# EAGLE design MOD-W_V02 (EAGLE 9.6.2)

## Sheet 1 of 2
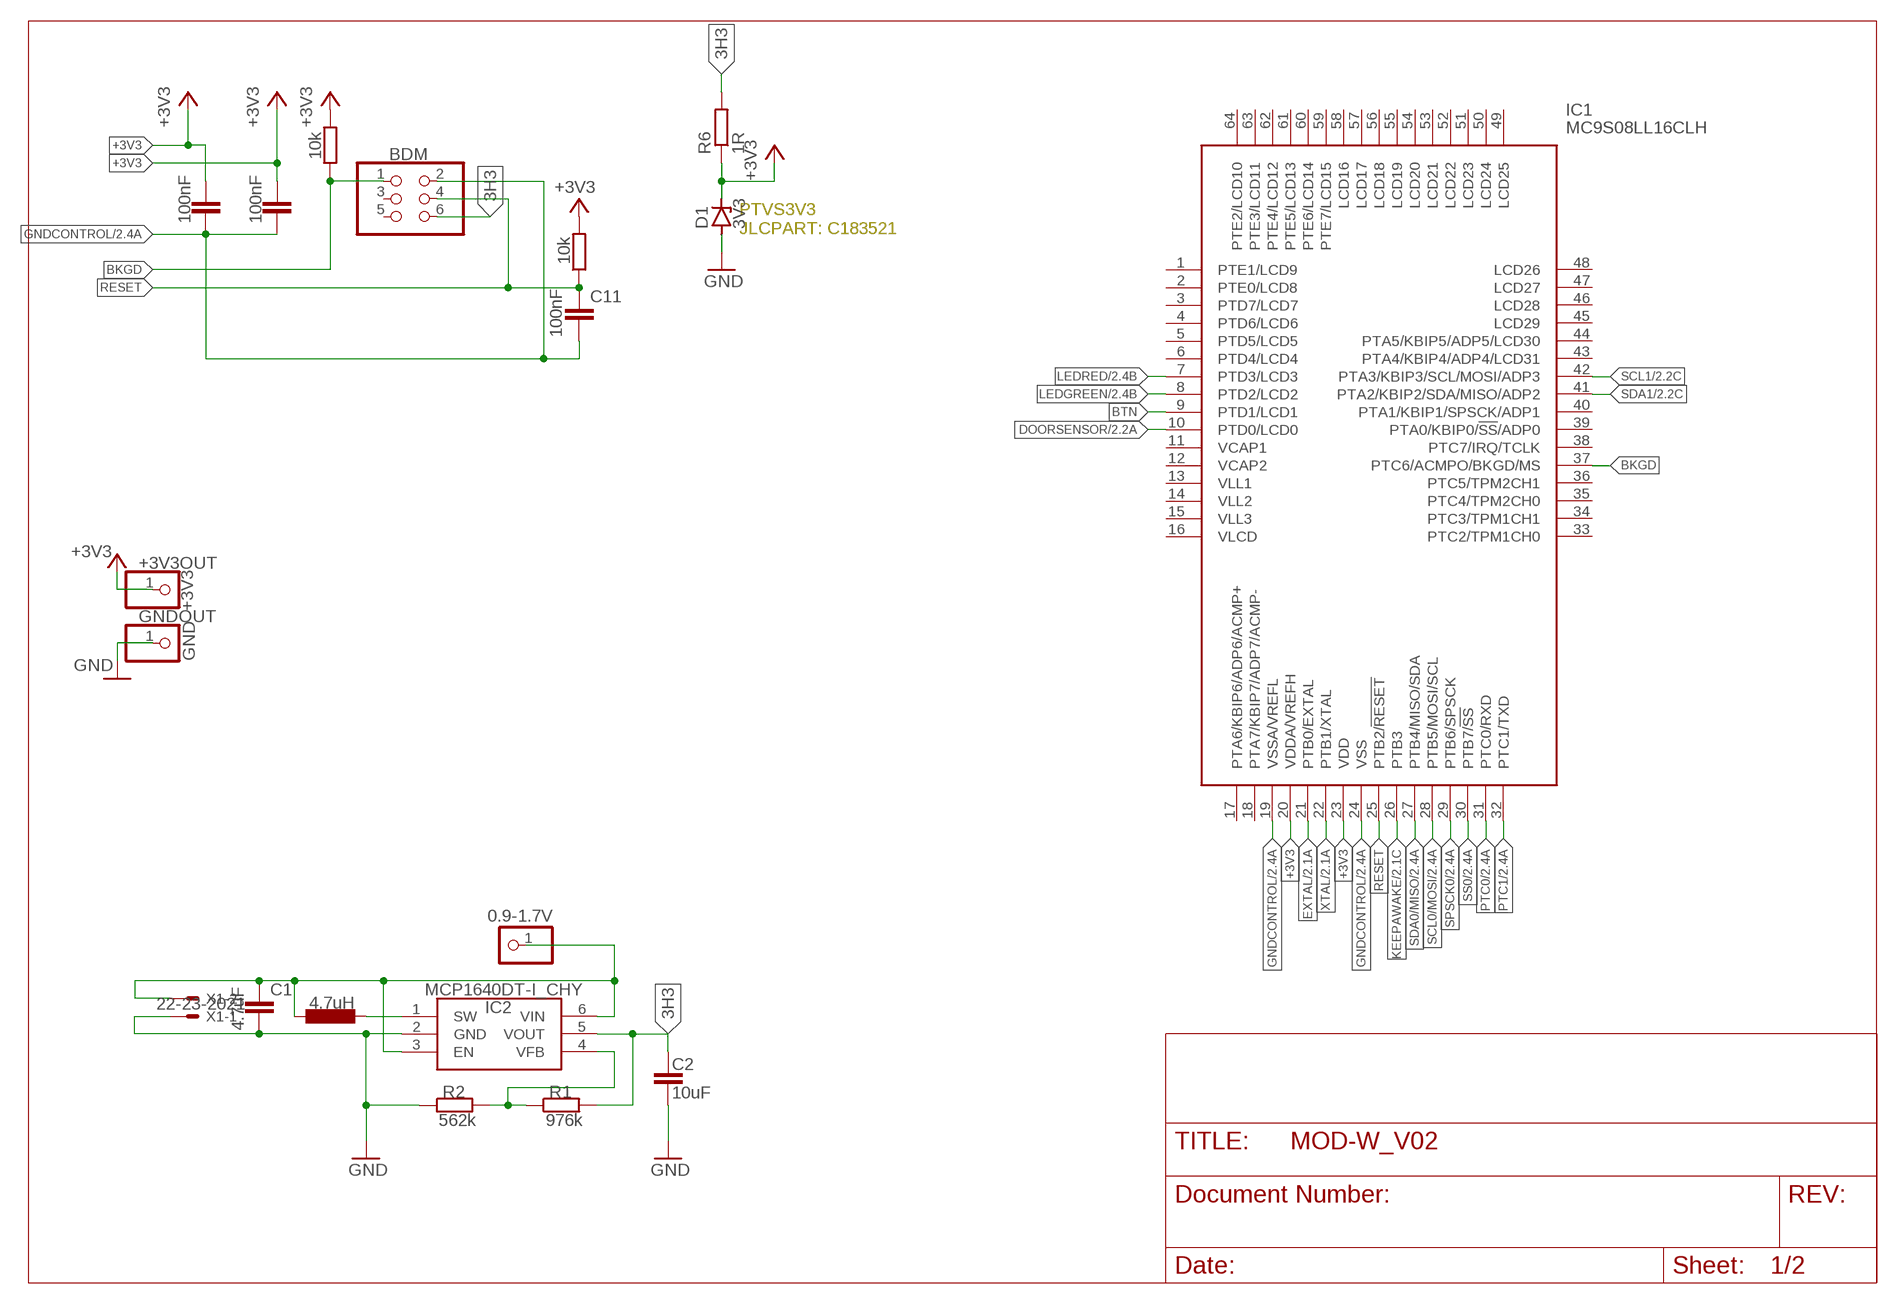
[diagram p0: schematic, sheet 1]

### Parts
+3V3OUT  +3V3  PINHD-1X1  [1X01]
BAT  0.9-1.7V  PINHD-1X1  [1X01]
BDM  PINHD-2X3  [2X03]
C1  4.7uF  C-EUC0805  [C0805]
C2  10uF  C-EUC0805  [C0805]
C9  100nF  C-EUC0805  [C0805]
C10  100nF  C-EUC0805  [C0805]
C11  100nF  C-EUC0805  [C0805]
D1  3V3  ZENER-DIODESOD80C  [SOD80C]
GNDOUT  GND  PINHD-1X1  [1X01]
IC1  MC9S08LL16CLH  [QFP50P1200X1200X160-64N]
IC2  MCP1640DT-I_CHY  [SOT95P270X145-6N]
L1  4.7uH  L-EUL2012C  [L2012C]
R1  976k  R-EU_R0805  [R0805]
R2  562k  R-EU_R0805  [R0805]
R6  1R  R-EU_R0805  [R0805]
R16  10k  R-EU_R0805  [R0805]
R17  10k  R-EU_R0805  [R0805]
X1  22-23-2021  [22-23-2021]

### Nets
3H3: BDM.6 C2.1 IC2.5(VOUT) R1.2 R6.2
+3V3: +3V3OUT.1 C9.1 C10.1 D1.C IC1.20(VDDA/VREFH) IC1.23(VDD) R6.1 R16.2 R17.2 ; also sheet 2
BKGD: BDM.1 IC1.37(PTC6/ACMPO/BKGD/MS) R16.1
BTN: IC1.9(PTD1/LCD1)
DOORSENSOR: IC1.10(PTD0/LCD0) ; also sheet 2
EXTAL: IC1.21(PTB0/EXTAL) ; also sheet 2
GND: C1.2 C2.2 D1.A GNDOUT.1 IC2.2(GND) R2.1 X1.1 ; also sheet 2
GNDCONTROL: BDM.2 C9.2 C10.2 C11.2 IC1.19(VSSA/VREFL) IC1.24(VSS) ; also sheet 2
KEEPAWAKE: IC1.26(PTB3) ; also sheet 2
LEDGREEN: IC1.8(PTD2/LCD2) ; also sheet 2
LEDRED: IC1.7(PTD3/LCD3) ; also sheet 2
N$2: BAT.1 C1.1 IC2.3(EN) IC2.6(VIN) L1.2 X1.2
N$5: IC2.4(VFB) R1.1 R2.2
N$7: IC2.1(SW) L1.1
PTC0: IC1.31(PTC0/RXD) ; also sheet 2
PTC1: IC1.32(PTC1/TXD) ; also sheet 2
RESET: BDM.4 C11.1 IC1.25(PTB2/!RESET) R17.1
SCL0/MOSI: IC1.28(PTB5/MOSI/SCL) ; also sheet 2
SCL1: IC1.42(PTA3/KBIP3/SCL/MOSI/ADP3) ; also sheet 2
SDA0/MISO: IC1.27(PTB4/MISO/SDA) ; also sheet 2
SDA1: IC1.41(PTA2/KBIP2/SDA/MISO/ADP2) ; also sheet 2
SPSCK0: IC1.29(PTB6/SPSCK) ; also sheet 2
SS0: IC1.30(PTB7/!SS) ; also sheet 2
XTAL: IC1.22(PTB1/XTAL) ; also sheet 2
Unconnected: BDM.3 BDM.5 IC1.1(PTE1/LCD9) IC1.2(PTE0/LCD8) IC1.3(PTD7/LCD7) IC1.4(PTD6/LCD6) IC1.5(PTD5/LCD5) IC1.6(PTD4/LCD4) IC1.11(VCAP1) IC1.12(VCAP2) IC1.13(VLL1) IC1.14(VLL2) IC1.15(VLL3) IC1.16(VLCD) IC1.17(PTA6/KBIP6/ADP6/ACMP+) IC1.18(PTA7/KBIP7/ADP7/ACMP-) IC1.33(PTC2/TPM1CH0) IC1.34(PTC3/TPM1CH1) IC1.35(PTC4/TPM2CH0) IC1.36(PTC5/TPM2CH1) IC1.38(PTC7/IRQ/TCLK) IC1.39(PTA0/KBIP0/!SS!/ADP0) IC1.40(PTA1/KBIP1/SPSCK/ADP1) IC1.43(PTA4/KBIP4/ADP4/LCD31) IC1.44(PTA5/KBIP5/ADP5/LCD30) IC1.45(LCD29) IC1.46(LCD28) IC1.47(LCD27) IC1.48(LCD26) IC1.49(LCD25) IC1.50(LCD24) IC1.51(LCD23) IC1.52(LCD22) IC1.53(LCD21) IC1.54(LCD20) IC1.55(LCD19) IC1.56(LCD18) IC1.57(LCD17) IC1.58(LCD16) IC1.59(PTE7/LCD15) IC1.60(PTE6/LCD14) IC1.61(PTE5/LCD13) IC1.62(PTE4/LCD12) IC1.63(PTE3/LCD11) IC1.64(PTE2/LCD10)

### Notes on the sheet
- PTVS3V3 
  JLCPART: C183521

## Sheet 2 of 2
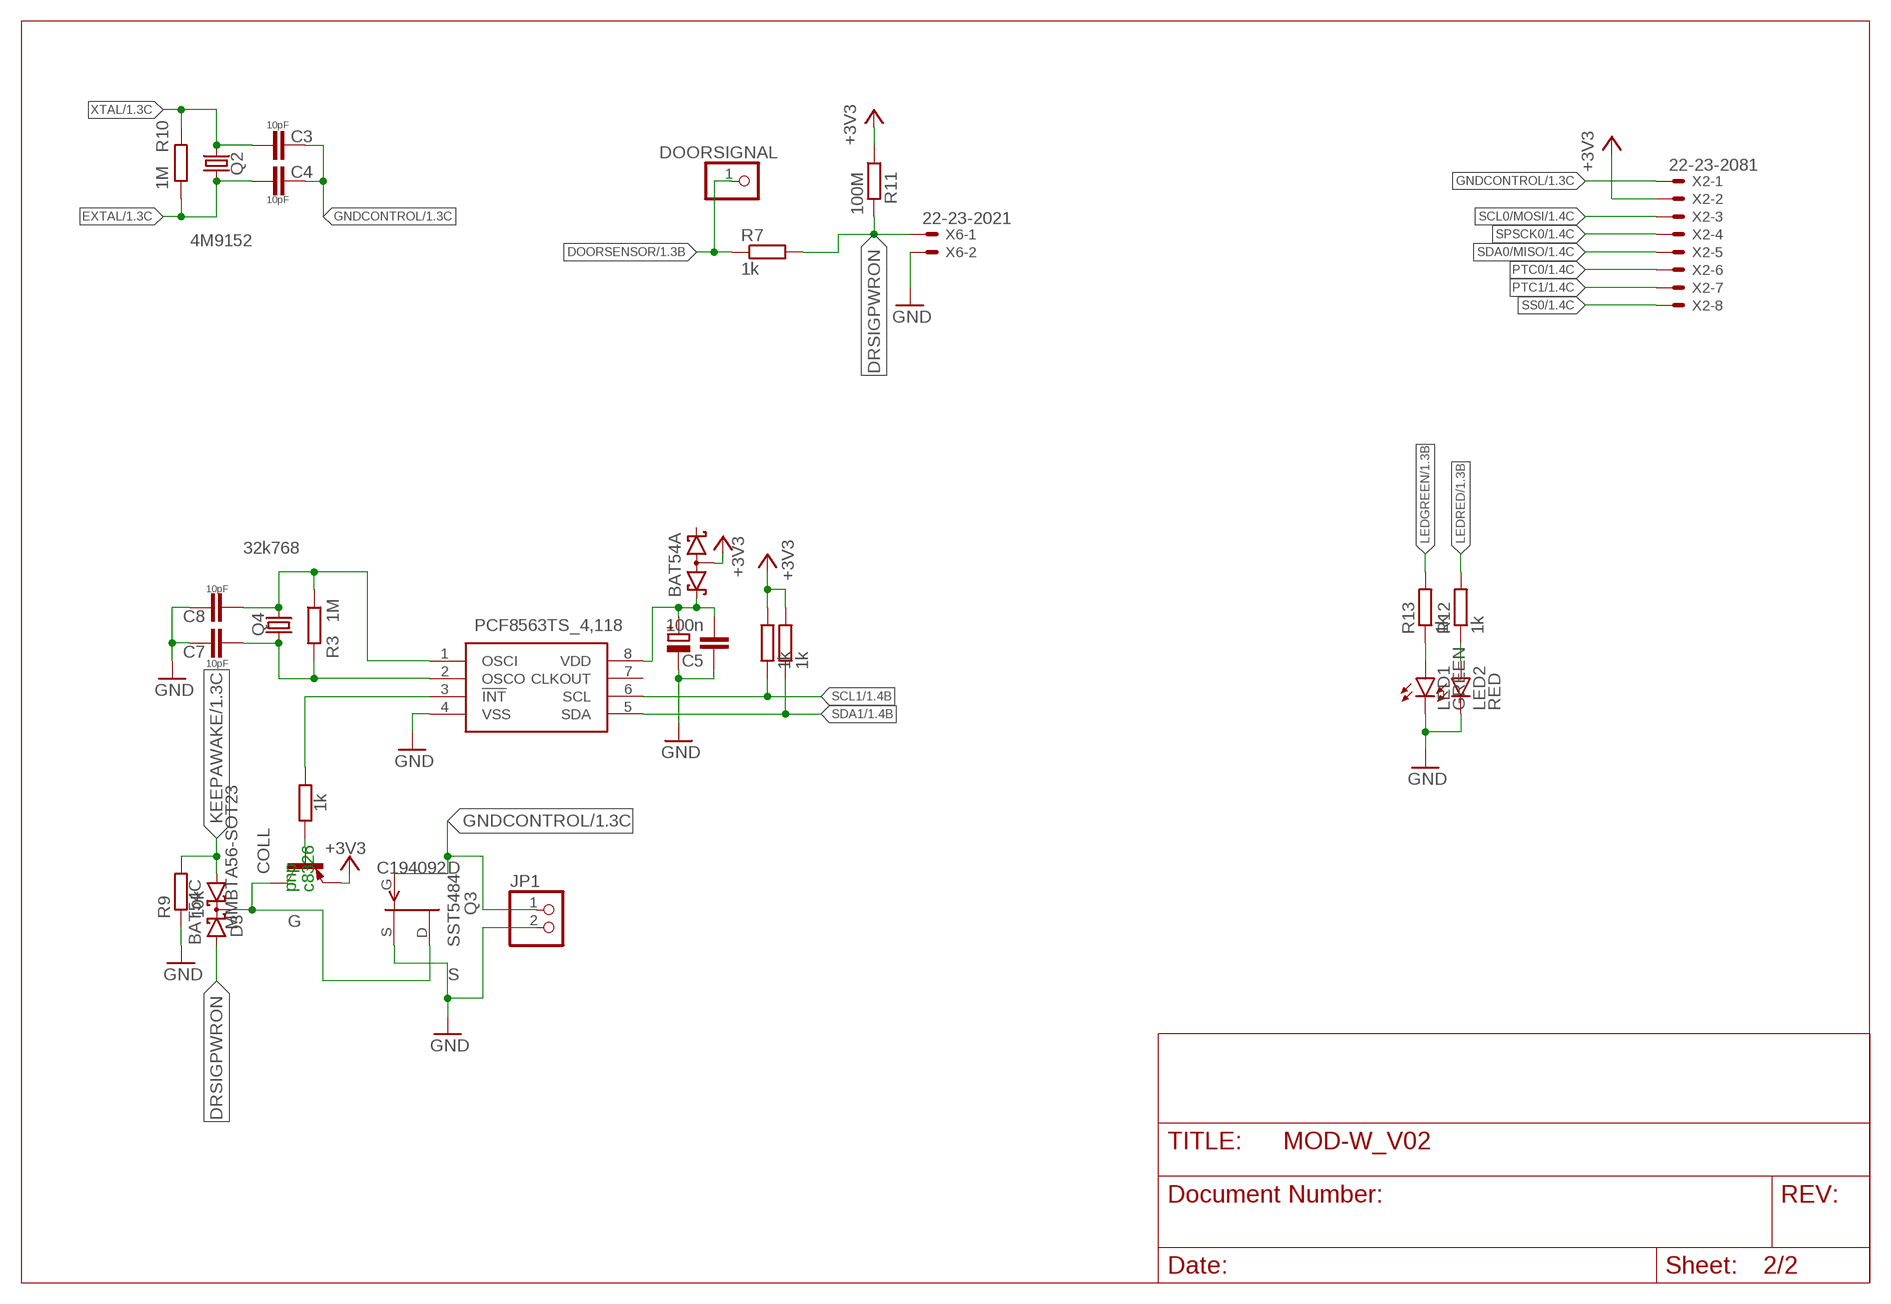
[diagram p1: schematic, sheet 2]

### Parts
C3  10pF  C-EUC0805  [C0805]
C4  10pF  C-EUC0805  [C0805]
C5  100n  C-EUC0805  [C0805]
C6  100u  CPOL-EUE  [PANASONIC_E]
C7  10pF  C-EUC0805  [C0805]
C8  10pF  C-EUC0805  [C0805]
D2  BAT54A  [SOT23]
D3  BAT54C  [SOT23]
DOORSIGNAL  PINHD-1X1  [1X01]
IC3  PCF8563TS_4,118  [SOP65P490X110-8N]
JP1  PINHD-1X2  [1X02]
LED1  GREEN  LEDCHIP-LED0805  [CHIP-LED0805]
LED2  RED  LEDCHIP-LED0805  [CHIP-LED0805]
Q1  MMBTA56-SOT23  [SOT23]
Q2  4M9152  CRYSTALHC49UP  [HC49UP]
Q3  SST5484  [SOT23]
Q4  32k768  CRYSTALTC38H  [TC38H]
R3  1M  R-EU_R0805  [R0805]
R4  1k  R-EU_R0805  [R0805]
R5  1k  R-EU_R0805  [R0805]
R7  1k  R-EU_R0805  [R0805]
R8  1k  R-EU_R0805  [R0805]
R9  10k  R-EU_R0805  [R0805]
R10  1M  R-EU_R0805  [R0805]
R11  100M  R-EU_R0805  [R0805]
R12  1k  R-EU_R0805  [R0805]
R13  1k  R-EU_R0805  [R0805]
X2  22-23-2081  [22-23-2081]
X6  22-23-2021  [22-23-2021]

### Nets
+3V3: D2.3(AA) Q1.2(E) R4.2 R5.2 R11.1 X2.2 ; also sheet 1
COLL: D3.3(CC) Q1.3(C) Q3.1(D)
DOORSENSOR: DOORSIGNAL.1 R7.1 ; also sheet 1
DRSIGPWRON: D3.2(A2) R7.2 R11.2 X6.1
EXTAL: C4.1 Q2.1 R10.1 ; also sheet 1
EXTAL1: C8.1 IC3.1(OSCI) Q4.1 R3.1
GND: C5.1 C6.- C7.2 C8.2 IC3.4(VSS) JP1.2 LED1.C LED2.C Q3.2(S) R9.1 X6.2 ; also sheet 1
GNDCONTROL: C3.2 C4.2 JP1.1 Q3.3(G) X2.1 ; also sheet 1
KEEPAWAKE: D3.1(A1) R9.2 ; also sheet 1
LEDGREEN: R13.2 ; also sheet 1
LEDRED: R12.2 ; also sheet 1
N$4: IC3.3(!INT) R8.2
N$10: LED1.A R13.1
N$11: LED2.A R12.1
N$16: Q1.1(B) R8.1
N$20: C5.2 C6.+ D2.2(K2) IC3.8(VDD)
PTC0: X2.6 ; also sheet 1
PTC1: X2.7 ; also sheet 1
SCL0/MOSI: X2.3 ; also sheet 1
SCL1: IC3.6(SCL) R4.1 ; also sheet 1
SDA0/MISO: X2.5 ; also sheet 1
SDA1: IC3.5(SDA) R5.1 ; also sheet 1
SPSCK0: X2.4 ; also sheet 1
SS0: X2.8 ; also sheet 1
XTAL: C3.1 Q2.2 R10.2 ; also sheet 1
XTAL1: C7.1 IC3.2(OSCO) Q4.2 R3.2
Unconnected: D2.1(K1) IC3.7(CLKOUT)

### Notes on the sheet
- C194092 | D
- pnp | c8326
- G
- S

## Library data of the parts
+3V3OUT BAT DOORSIGNAL GNDOUT = pinhead:PINHD-1X1: PIN HEADER
BDM = pinhead:PINHD-2X3: PIN HEADER
C1-C5 C7-C11 = rcl:C-EU: CAPACITOR, European symbol; SPICEPREFIX: C
C6 = rcl:CPOL-EU: POLARIZED CAPACITOR, European symbol; SPICEPREFIX: C
D1 = diode:ZENER-DIODE: Z-Diode
D2 = diode:BAT54A: Schottky Diodes Source: Fairchild .. BAT54.pdf
D3 = diode:BAT54C: Schottky Diodes Source: Fairchild .. BAT54.pdf
IC1 = MC9S08LL16CLH:MC9S08LL16CLH: MCU 8-bit S08 CISC 16KB Flash 2.5V/3.3V 64-Pin LQFP Tray Source: Datasheet <http://www.nxp.com/docs/en/data-sheet/MC9S08LL16.pdf>; ARROW_PART_NUMBER: MC9S08LL16CLH; ARROW_PRICE-STOCK: https://www.arrow.com/en/products/mc9s08ll16clh/nxp-semiconductors; DESCRIPTION: MCU 8-bit S08 CISC 16KB Flash 2.5V/3.3V 64-Pin LQFP Tray; HEIGHT: 1.6mm; MANUFACTURER_NAME: NXP; MANUFACTURER_PART_NUMBER: MC9S08LL16CLH; MOUSER_PART_NUMBER: 841-MC9S08LL16CLH; MOUSER_PRICE-STOCK: https://www.mouser.com/Search/Refine.aspx?Keyword=841-MC9S08LL16CLH
IC2 = MCP1640DT-I_CHY:MCP1640DT-I_CHY: MICROCHIP - MCP1640DT-I/CHY - DC-DC Switching Boost Step Up Regulator, Adjustable, 650mV-5.5Vin, 2V-5.5Vout, 350mAout, SOT-23-6 Source: Datasheet <http://ww1.microchip.com/downloads/en/DeviceDoc/20002234D.pdf>; ARROW_PART_NUMBER: MCP1640DT-I/CHY; ARROW_PRICE-STOCK: https://www.arrow.com/en/products/mcp1640dt-ichy/microchip-technology?region=nac; DESCRIPTION: MICROCHIP - MCP1640DT-I/CHY - DC-DC Switching Boost Step Up Regulator, Adjustable, 650mV-5.5Vin, 2V-5.5Vout, 350mAout, SOT-23-6; HEIGHT: 1.45mm; MANUFACTURER_NAME: Microchip; MANUFACTURER_PART_NUMBER: MCP1640DT-I/CHY; MOUSER_PART_NUMBER: 579-MCP1640DT-I/CHY; MOUSER_PRICE-STOCK: https://www.mouser.co.uk/ProductDetail/Microchip-Technology/MCP1640DT-I-CHY?qs=Z2DEGP6RHSmcahvjAPXzWA%3D%3D
IC3 = PCF8563TS_4_118:PCF8563TS_4,118: Real Time Clock ULTRA LOW PWR CLOCK RTC IC Source: Datasheet <http://www.nxp.com/docs/en/data-sheet/PCF8563.pdf>; ARROW_PART_NUMBER: PCF8563TS/4,118; ARROW_PRICE-STOCK: https://www.arrow.com/en/products/pcf8563ts4118/nxp-semiconductors?region=nac; DESCRIPTION: Real Time Clock ULTRA LOW PWR CLOCK RTC IC; HEIGHT: 1.1mm; MANUFACTURER_NAME: NXP; MANUFACTURER_PART_NUMBER: PCF8563TS/4,118; MOUSER_PART_NUMBER: 771-PCF8563TS-T; MOUSER_PRICE-STOCK: https://www.mouser.co.uk/ProductDetail/NXP-Semiconductors/PCF8563TS-4118?qs=LOCUfHb8d9ugg%2FdJSyv6Ig%3D%3D
JP1 = pinhead:PINHD-1X2: PIN HEADER
L1 = rcl:L-EU: INDUCTOR, European symbol; SPICEPREFIX: L
LED1 LED2 = led:LED: LED OSRAM: - CHIPLED LG R971, LG N971, LY N971, LG Q971, LY Q971, LO R971, LY R971 LH N974, LH R974 LS Q976, LO Q976, LY Q976 LO Q996 - Hyper CHIPLED LW Q18S LB Q993, LB Q99A, LB R99A - SideLED LS A670, LO A670, LY A670, LG A670, LP A670 LB A673, LV A673, LT A673, LW A673 LH A674 LY A675 LS A676, LA A676, LO A676, LY A676, LW A676 LS A679, LY A679, LG A679 - Hyper Micro SIDELED® LS Y876, LA Y876, LO Y876, LY Y876 LT Y87S - SmartLED LW L88C, LW L88S LB L89C, LB L89S, LG L890 LS L89K, LO L89K, LY L89K LS L896, LA L896, LO L896, LY L896 - TOPLED LS T670, LO T670, LY T670, LG T670, LP T670 LSG T670, LSP T670, LSY T670, LOP T670, LYG T670 LG T671, LOG T671, LSG T671 LB T673, LV T673, LT T673, LW T673 LH T674 LS T676, LA T676, LO T676, LY T676, LB T676, LH T676, LSB T676, LW T676 LB T67C, LV T67C, LT T67C, LS T67K, LO T67K, LY T67K, LW E67C LS E67B, LA E67B, LO E67B, LY E67B, LB E67C, LV E67C, LT E67C LW T67C LS T679, LY T679, LG T679 LS T770, LO T770, LY T770, LG T770, LP T770 LB T773, LV T773, LT T773, LW T773 LH T774 LS E675, LA E675, LY E675, LS T675 LS T776, LA T776, LO T776, LY T776, LB T776 LHGB T686 LT T68C, LB T68C - Hyper Mini TOPLED® LB M676 - Mini TOPLED Santana® LG M470 LS M47K, LO M47K, LY M47K Source: http://www.osram.convergy.de LUXEON: - LUMILED® LXK2-PW12-R00, LXK2-PW12-S00, LXK2-PW14-U00, LXK2-PW14-V00 LXK2-PM12-R00, LXK2-PM12-S00, LXK2-PM14-U00 LXK2-PE12-Q00, LXK2-PE12-R00, LXK2-PE12-S00, LXK2-PE14-T00, LXK2-PE14-U00 LXK2-PB12-K00, LXK2-PB12-L00, LXK2-PB12-M00, LXK2-PB14-N00, LXK2-PB14-P00, LXK2-PB14-Q00 LXK2-PR12-L00, LXK2-PR12-M00, LXK2-PR14-Q00, LXK2-PR14-R00 LXK2-PD12-Q00, LXK2-PD12-R00, LXK2-PD12-S00 LXK2-PH12-R00, LXK2-PH12-S00 LXK2-PL12-P00, LXK2-PL12-Q00, LXK2-PL12-R00 Source: www.luxeon.com KINGBRIGHT: KA-3528ASYC Source: www.kingbright.com
Q1 = transistor-pnp:*-?: PNP Transistor
Q2 Q4 = crystal:CRYSTAL: CRYSTAL; OC_FARNELL: unknown; OC_NEWARK: unknown
Q3 = transistor-fet:?548*: N-Channel JFETs Source: VISHAY 2N5484.pdf Compatible: TO92 2N5245 J304 J305 U310 J308 J309 J310 TO72 2N4416 2N4416A 2N3823 2N4351 3N169 3N170 3N171 MFE3002 TO18 2N3796 2N3797 MFE825 Source: Motorola European Master Guide Pacge 3-59
R1-R13 R16 R17 = rcl:R-EU_: RESISTOR, European symbol; SPICEPREFIX: R
X1 X6 = con-molex:22-23-2021: .100" (2.54mm) Center Header - 2 Pin; MF: MOLEX; MPN: 22-23-2021; OC_FARNELL: 1462926; OC_NEWARK: 25C3832
X2 = con-molex:22-23-2081: .100" (2.54mm) Center Header - 8 Pin; MF: MOLEX; MPN: 22-23-2081; OC_FARNELL: 1756826; OC_NEWARK: 01C7592

## Board
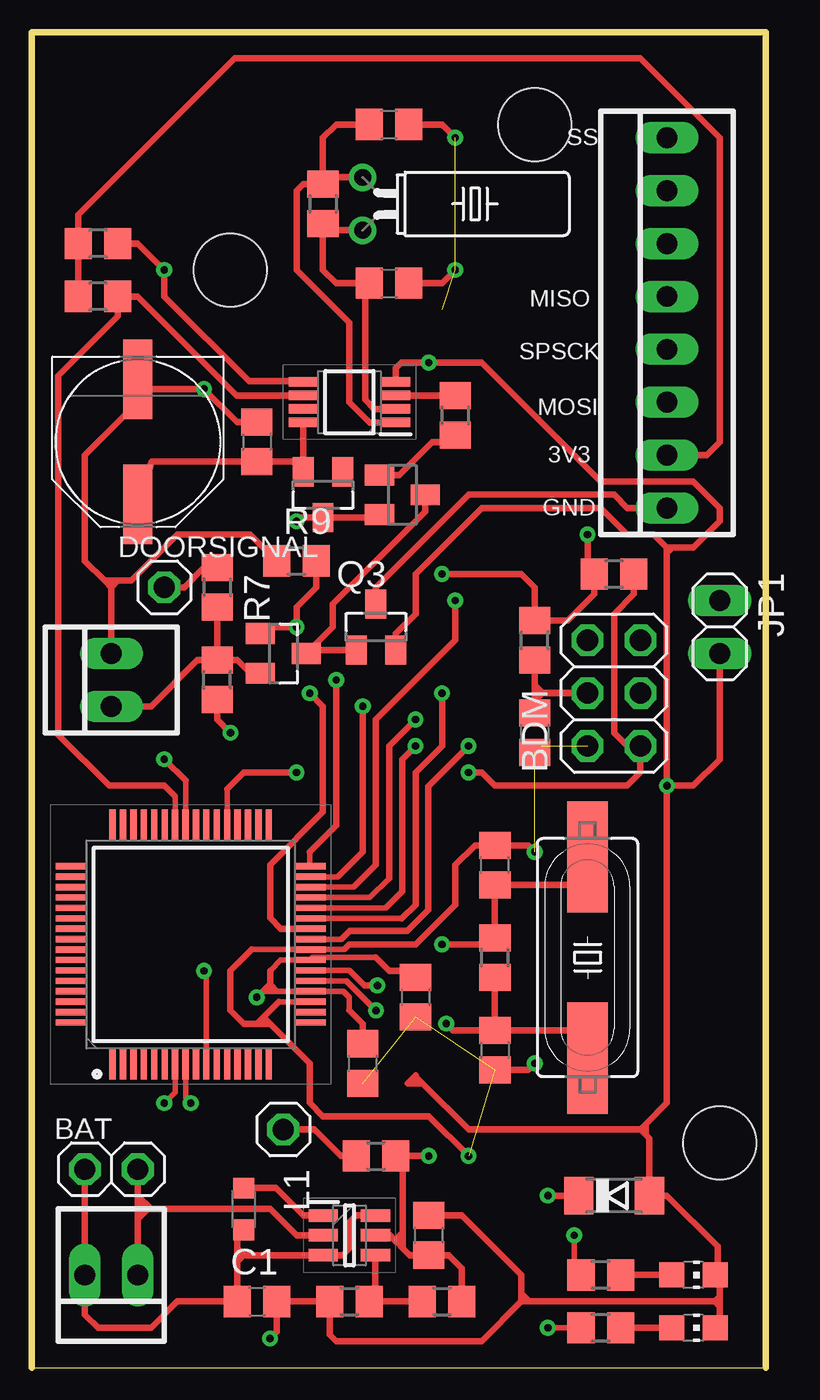
[diagram p2: board, top side]
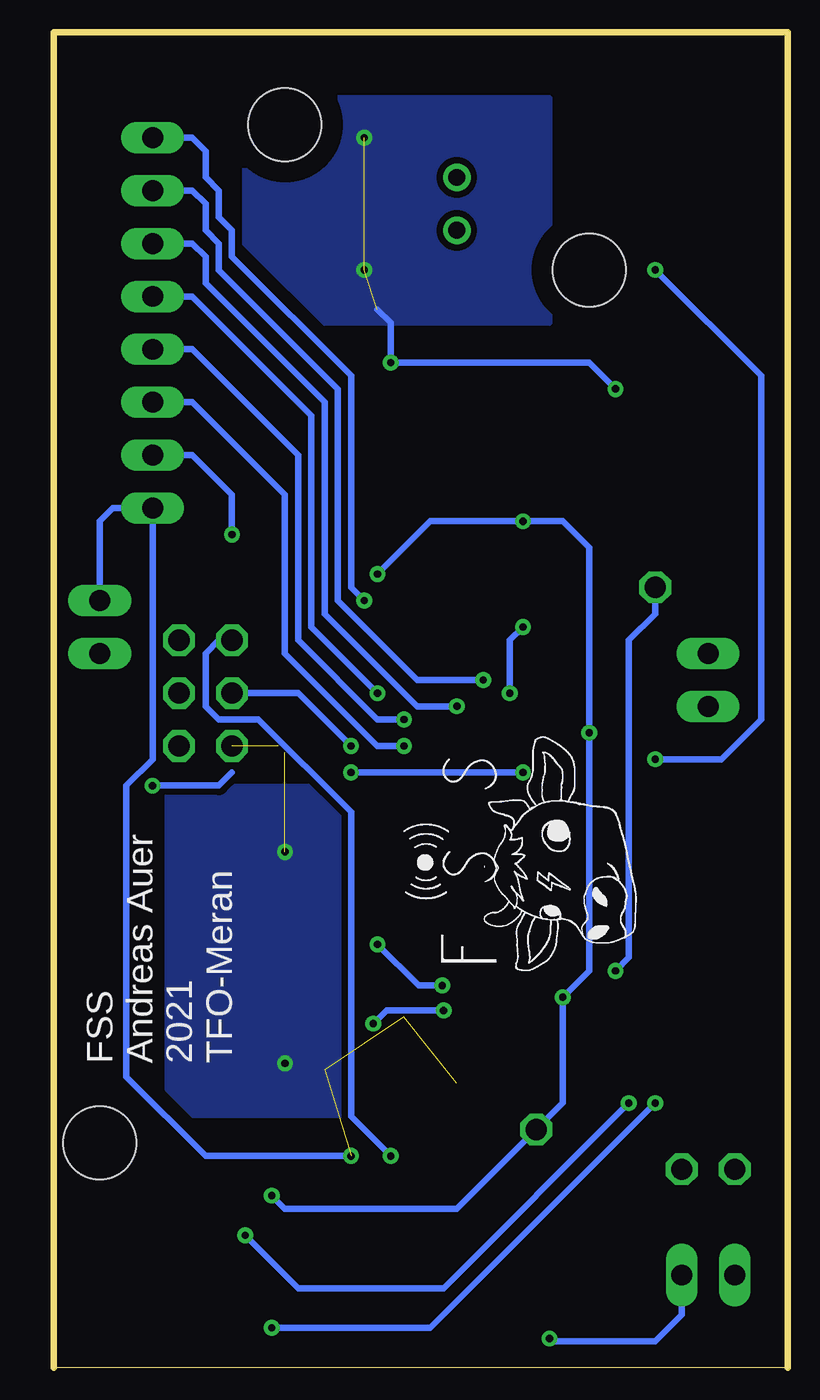
[diagram p3: board, bottom side, seen from below]

No outline drawn. Coordinates in mm, seen from the top.
Copper layers (1*16): Top 0.035mm / dielectric 1.5mm / Bottom 0.035mm
Design rules "default *": minimum track width 6mil, minimum drill 0.35mm, track to track 12mil, track to pad 12mil, pad to pad 12mil, via to via 12mil, smd to smd 12mil, copper to edge 40mil, drill to drill 12mil, minimum pad ring 10mil, minimum via ring 8mil, stop-mask expansion 4mil, vias tented up to drill 0mil, thermal gap 10mil
Holes 3.5 mm at 9.53,52.7 33.02,10.79 24.13,59.69
Milling: 4 lines

### Footprints (pad centres in the part's own frame; a part is rotated, then mirrored left to right if it is on the bottom)
1X01 = drill 1.016 octagon: 1 0,0
2X03 = drill 1.016 octagon: 1 -2.54,-1.27; 2 -2.54,1.27; 3 0,-1.27; 4 0,1.27; 5 2.54,-1.27; 6 2.54,1.27
C0805 = smd 1.3 x 1.5: 1 -0.95,0; 2 0.95,0
PANASONIC_E = smd 3.8 x 1.4: + 3,0; - -3,0
SOD80C = smd 1.4 x 1.8: A 1.7,0; C -1.7,0
SOT23 = smd 1 x 1.4: 1 -0.95,-1.1; 2 0.95,-1.1; 3 0,1.1
QFP50P1200X1200X160-64N = smd 1.475 x 0.3: 1 -5.738,3.75; 2 -5.738,3.25; 3 -5.738,2.75; 4 -5.738,2.25; 5 -5.738,1.75; 6 -5.738,1.25; 7 -5.738,0.75; 8 -5.738,0.25; 9 -5.738,-0.25; 10 -5.738,-0.75; 11 -5.738,-1.25; 12 -5.738,-1.75; 13 -5.738,-2.25; 14 -5.738,-2.75; 15 -5.738,-3.25; 16 -5.738,-3.75; 33 5.738,-3.75; 34 5.738,-3.25; 35 5.738,-2.75; 36 5.738,-2.25; 37 5.738,-1.75; 38 5.738,-1.25; 39 5.738,-0.75; 40 5.738,-0.25; 41 5.738,0.25; 42 5.738,0.75; 43 5.738,1.25; 44 5.738,1.75; 45 5.738,2.25; 46 5.738,2.75; 47 5.738,3.25; 48 5.738,3.75 | smd 0.3 x 1.475: 17 -3.75,-5.738; 18 -3.25,-5.738; 19 -2.75,-5.738; 20 -2.25,-5.738; 21 -1.75,-5.738; 22 -1.25,-5.738; 23 -0.75,-5.738; 24 -0.25,-5.738; 25 0.25,-5.738; 26 0.75,-5.738; 27 1.25,-5.738; 28 1.75,-5.738; 29 2.25,-5.738; 30 2.75,-5.738; 31 3.25,-5.738; 32 3.75,-5.738; 49 3.75,5.738; 50 3.25,5.738; 51 2.75,5.738; 52 2.25,5.738; 53 1.75,5.738; 54 1.25,5.738; 55 0.75,5.738; 56 0.25,5.738; 57 -0.25,5.738; 58 -0.75,5.738; 59 -1.25,5.738; 60 -1.75,5.738; 61 -2.25,5.738; 62 -2.75,5.738; 63 -3.25,5.738; 64 -3.75,5.738
SOT95P270X145-6N = smd 1.4 x 0.6: 1 -1.25,0.95; 2 -1.25,0; 3 -1.25,-0.95; 4 1.25,-0.95; 5 1.25,0; 6 1.25,0.95
SOP65P490X110-8N = smd 1.425 x 0.45: 1 -2.212,0.975; 2 -2.212,0.325; 3 -2.212,-0.325; 4 -2.212,-0.975; 5 2.212,-0.975; 6 2.212,-0.325; 7 2.212,0.325; 8 2.212,0.975
1X02 = drill 1.016 long: 1 -1.27,0; 2 1.27,0
L2012C = smd 1 x 1: 1 -1,0; 2 1,0
CHIP-LED0805 = smd 1.2 x 1.2: A 0,-1.05; C 0,1.05
HC49UP = smd 5.334 x 1.93: 1 -4.826,0; 2 4.826,0
TC38H = drill 0.813: 1 -1.27,0; 2 1.27,0
R0805 = smd 1.3 x 1.5: 1 -0.95,0; 2 0.95,0
22-23-2021 = drill 1 long: 1 -1.27,0; 2 1.27,0
22-23-2081 = drill 1 long: 1 -8.89,0; 2 -6.35,0; 3 -3.81,0; 4 -1.27,0; 5 1.27,0; 6 3.81,0; 7 6.35,0; 8 8.89,0

### Placement (x,y rotation side)
+3V3OUT  12.06,11.43 0 top
BAT  2.54,9.53 0 top
BDM  27.94,32.38 90 top
C1  10.79,3.17 0 top
C2  19.05,6.35 90 top
C3  22.23,24.13 90 top
C4  22.23,15.24 270 top
C5  10.79,44.45 270 top
C6  5.08,44.45 270 top
C7  17.14,52.07 0 top
C8  17.14,59.69 0 top
C9  15.88,14.61 270 top
C10  18.41,17.78 270 top
C11  24.13,30.48 270 top
D1  27.94,8.26 0 top
D2  13.97,41.91 180 top
D3  12.06,34.29 270 top
DOORSIGNAL  6.35,37.47 0 top
GNDOUT  5.08,9.53 0 top
IC1  7.62,20.32 90 top
IC2  15.24,6.35 0 top
IC3  15.24,46.35 180 top
JP1  33.02,35.56 270 top
L1  10.16,7.62 270 top
LED1  31.75,4.45 270 top
LED2  31.75,1.91 270 top
Q1  17.78,41.91 270 top
Q2  26.67,19.68 90 top
Q3  16.51,35.56 0 top
Q4  15.88,55.88 270 top
R1  19.68,3.17 0 top
R2  15.24,3.17 0 top
R3  13.97,55.88 270 top
R4  3.17,51.44 180 top
R5  3.17,53.98 180 top
R6  16.51,10.16 0 top
R7  8.89,37.47 270 top
R8  20.32,45.72 90 top
R9  12.7,38.73 0 top
R10  22.23,19.68 90 top
R11  8.89,33.02 90 top
R12  27.3,1.91 180 top
R13  27.3,4.45 180 top
R16  27.94,38.1 180 top
R17  24.13,34.92 90 top
X1  3.81,4.45 180 top
X2  30.48,50.16 90 top
X6  3.81,33.02 90 top

### Tracks (layer width: path | path; a pad name or v marks a point on that pad's centre or on a via)
3H3  (via drill 0.35)
  Top 0.305: R1.2 20.64,4.76 20,5.4 C2.1 18.14,5.4 17.8,5.74 | IC2.5 17.19,6.35 17.42,6.12 | 17.8,5.74 17.55,5.99 | 17.55,5.99 17.42,6.12 | 17.8,6.5 17.8,9.82 R6.2 v19.05,10.16 | 17.8,6.24 17.8,5.74 | 17.42,6.12 17.8,6.5 | 17.8,6.24 17.55,5.99 | 17.8,6.5 17.8,6.24
  Bottom 0.305: v19.05,10.16 20.95,12.06 20.95,26.67 25.4,31.11 27.3,31.11 27.94,31.75 27.94,34.29 27.3,34.92 BDM.6
+3V3  (via drill 0.35)
  Top 0.254: 11.43,19.05 11.95,19.57 IC1.23 13.47,19.68 16.51,19.68 | 11.78,18.07 IC1.20 14.95,18.07 15.24,17.78 15.24,17.14 | 11.78,18.07 11.43,18.41 | 11.09,18.07 11.52,18.07 | 11.78,18.07 11.52,18.07 | 11.52,18.07 11.3,18.29
  Top 0.305: 11.43,19.05 11.43,18.41 11.3,18.29 11.09,18.07 v10.79,17.78 | X2.2 32.38,43.81 33.02,44.45 33.02,59.05 29.21,62.87 9.73,62.87 2.23,55.36 R5.2 R4.2 | Q1.2 16.53,40.81 D2.3 12.87,40.81 v12.7,40.64 | v19.68,38.1 23.5,38.1 24.13,37.47 R17.2 25.71,35.88 26.99,37.15 R16.2 26.67,38.42 v26.67,40.01 | 16.51,19.68 17.14,19.05 18.09,19.05 C10.1 | 15.24,17.14 15.88,16.51 C9.1 | R6.1 14.83,10.16 13.56,11.43 +3V3OUT.1 | v24.77,8.26 D1.C | R11.1 8.89,31.11 v9.53,30.48
  Bottom 0.305: v19.68,38.1 17.14,40.64 v12.7,40.64 10.79,40.64 9.53,39.37 v9.53,30.48 9.53,19.05 v10.79,17.78 10.79,12.7 +3V3OUT.1 15.88,7.62 24.13,7.62 v24.77,8.26 | v26.67,40.01 26.67,41.91 28.57,43.81 X2.2
BKGD  (via drill 0.35)
  Top 0.254: IC1.37 9.37,27.79
  Top 0.305: R16.1 28.89,37.15 27.94,36.2 27.94,30.48 28.57,29.84 BDM.1 29.21,28.57 28.57,27.94 22.23,27.94 21.59,28.57 v20.95,28.57 | 9.37,27.79 10.16,28.57 v12.7,28.57
  Bottom 0.305: v12.7,28.57 v20.95,28.57
COLL
  Top 0.305: Q3.1 13.34,34.46 D3.3 14.44,35.56 14.44,36.66 18.88,41.1 Q1.3
DOORSENSOR  (via drill 0.35)
  Top 0.254: IC1.10 8.37,18.93
  Top 0.305: v8.26,19.05 8.37,18.93 | R7.1 8.26,38.41 7.3,37.47 DOORSIGNAL.1
  Bottom 0.305: v8.26,19.05 7.62,19.68 7.62,34.92 6.35,36.2 DOORSIGNAL.1
DRSIGPWRON
  Top 0.305: X6.1 5.71,31.75 7.93,33.97 R11.2 | R11.2 R7.2 | R11.2 9.85,33.97 10.47,33.34 D3.2
EXTAL  (via drill 0.35)
  Top 0.152: Q2.1 26.67,15.24 25.72,16.19
  Top 0.254: IC1.21 15.09,18.57 v16.51,17.14
  Top 0.305: C4.1 R10.1 | C4.1 25.72,16.19 | v19.89,16.51 20.2,16.19 C4.1
  Bottom 0.305: v19.89,16.51 19.25,17.14 v16.51,17.14
EXTAL1
  Top 0.305: IC3.1 16.21,45.38 15.24,46.35 15.24,50.16 12.7,52.7 12.7,56.52 13.02,56.83 R3.1 | C8.1 14.61,59.69 13.97,59.05 R3.1 | R3.1 14.29,57.15 Q4.1
GND  (via drill 0.35)  (2 unrouted)
  Top 0.254: 33.02,2.12 LED2.C
  Top 0.305: IC2.2 12.7,6.35 11.43,7.62 5.71,7.62 | X1.1 5.08,7.11 | 5.08,7.11 5.08,7.75 | 5.08,7.75 5.08,8.13 | 5.08,8.13 5.08,8.26 | 5.08,8.26 GNDOUT.1 | v11.43,1.39 11.74,1.71 C1.2 R2.1 14.29,1.58 14.61,1.27 21.59,1.27 23.5,3.17 | C5.1 9.85,45.4 v8.26,46.99 5.14,46.99 C6.- 5.08,46.35 2.54,43.81 2.54,38.73 3.49,37.78 | IC3.4 17.45,48 17.71,48.26 v19.05,48.26 21.59,48.26 27.3,42.55 31.75,42.55 33.02,41.27 33.02,40.64 31.75,39.37 30.73,39.37 | 18.73,13.65 18.41,13.97 18.41,14.04 18.03,13.65 18.73,13.65 | v30.48,27.94 30.48,12.7 29.46,11.68 | 23.5,3.17 23.88,3.17 | 23.88,3.17 32.77,3.17 | 33.02,3.43 33.02,3.17 | 33.02,3.17 33.02,2.92 | 33.02,2.92 33.02,2.12 | 33.02,3.17 32.77,3.17 | 32.77,3.17 33.02,3.43 | 32.77,3.17 33.02,2.92 | 5.08,8.26 5.71,7.62 | 5.59,7.62 5.08,7.11 | 5.59,7.62 5.21,7.62 5.08,7.75 | 5.71,7.62 5.59,7.62 | 5.59,7.62 5.08,8.13 | C7.2 19.68,52.07 v20.32,52.7 | C8.2 19.68,59.69 v20.32,59.05 | LED1.C 32.91,4.33 | 32.91,4.33 33.02,4.22 33.02,3.43 | 32.91,4.33 32.91,5.83 30.48,8.26 D1.A 29.64,11 29.46,11.18 | 30.48,39.37 29.84,40.01 28.57,40.01 27.3,41.27 21.59,41.27 18.41,38.1 18.41,36.2 17.46,35.24 Q3.2 | v30.48,27.94 30.48,39.12 | 30.48,39.12 30.48,39.37 | 30.73,39.37 30.48,39.37 | 30.48,39.12 30.73,39.37 | 18.73,13.65 20.95,11.43 29.21,11.43 | 29.21,11.43 29.46,11.68 | 29.46,11.18 29.21,11.43 | 29.46,11.68 29.46,11.18 | C2.2 20.64,7.3 23.5,4.45 23.5,3.56 | 23.5,3.56 23.5,3.17 | 23.88,3.17 23.5,3.56 | v30.48,27.94 31.75,27.94 33.02,29.21 JP1.2 | X6.2 3.81,37.47 | 3.81,37.47 3.49,37.78 | R9.1 10.48,40.01 6.99,40.01 4.76,37.78 4.13,37.78 | 4.13,37.78 3.81,37.47 | 4.13,37.78 3.49,37.78
  Bottom 0.305: X1.1 5.08,2.54 6.35,1.27 11.43,1.27 v11.43,1.39 | v8.26,46.99 9.53,48.26 v19.05,48.26 19.05,50.16 19.68,50.8 | 26.67,28.57 27.3,27.94 v30.48,27.94
  pour Bottom: 11.43,60.96 22.86,60.96 26.04,57.78 26.04,53.98 25.4,53.34 22.23,50.16 20.32,50.16 11.43,50.16
GNDCONTROL  (via drill 0.35)  (5 unrouted)
  Top 0.254: 10.54,20.07 IC1.24 14.99,20.07 15.24,20.32 | IC1.19 11.86,17.57 | 11.18,16.76 11.18,16.89
  Top 0.305: 10.54,20.07 9.53,19.05 9.53,17.14 10.16,16.51 10.79,16.51 | C4.2 23.82,14.29 v24.13,14.61 | C3.2 23.82,25.08 v24.13,24.77 | C3.2 22.23,24.77 | 15.24,20.32 18.41,20.32 20.32,22.23 20.32,24.13 21.27,25.08 C3.2 | 11.86,17.57 11.18,16.89 10.79,16.51 | 11.43,16.51 10.79,16.51 | 11.43,16.51 11.18,16.76 | Q3.3 16.51,37.47 20.95,41.91 27.94,41.91 28.57,41.27 X2.1 | v20.95,10.16 19.05,12.06 13.97,12.06 13.34,12.7 13.34,14.61 11.43,16.51 | C11.2 24.45,29.84
  Bottom 0.305: JP1.1 33.02,40.64 32.38,41.27 X2.1 30.48,29.21 31.75,27.94 31.75,13.97 27.94,10.16 v20.95,10.16
  pour Bottom: 20.95,27.94 29.84,27.94 29.84,13.34 28.57,12.06 20.95,12.06
KEEPAWAKE  (via drill 0.35)
  Top 0.305: IC1.26 11.95,21.07 11.43,21.59 11.43,24.13 13.97,26.67 13.97,31.75 v13.34,32.38 | D3.1 11.29,35.56 v12.7,35.56 12.7,36.52 13.65,37.47 R9.2
  Bottom 0.305: v13.34,32.38 13.34,34.92 v12.7,35.56
LEDGREEN  (via drill 0.35)
  Top 0.254: R13.2 26.04,4.76 v26.04,6.35 | IC1.8 7.37,12.95 v7.62,12.7
  Bottom 0.305: v26.04,6.35 23.5,3.81 16.51,3.81 v7.62,12.7
LEDRED  (via drill 0.35)
  Top 0.254: R12.2 v24.77,1.91 | IC1.7 6.87,13.22 v6.35,12.7
  Bottom 0.305: v6.35,12.7 17.14,1.91 v24.77,1.91
N$2
  Top 0.305: IC2.6 15.55,7.3 15.24,6.99 15.24,5.71 14.93,5.4 IC2.3 10.16,5.4 | BAT.1 X1.2 2.54,2.54 3.17,1.91 5.71,1.91 6.99,3.17 C1.1 9.85,5.08 | L1.2 9.85,6.3 9.85,5.71 | 9.85,5.71 9.85,5.08 | 9.85,5.08 10.16,5.4 | 10.16,5.4 9.85,5.71
N$4
  Top 0.305: IC3.3 R8.2
N$5
  Top 0.305: IC2.4 16.49,3.48 R2.2 R1.1
N$7
  Top 0.305: IC2.1 13.02,7.3 11.7,8.62 L1.1
N$10
  Top 0.305: LED1.A R13.1
N$11
  Top 0.305: R12.1 LED2.A
N$16
  Top 0.305: Q1.1 17.63,42.86 19.22,44.45 20.32,44.45 R8.1
N$20
  Top 0.305: IC3.8 D2.2 12.53,43.5 C5.2 5.75,43.5 C6.+
PTC0  (via drill 0.35)
  Top 0.254: IC1.31 14.68,23.57 15.88,24.77
  Top 0.305: 15.88,24.77 v15.88,31.75
  Bottom 0.305: X2.6 28.57,53.98 27.94,53.34 27.94,52.07 22.23,46.35 22.23,36.2 17.78,31.75 v15.88,31.75
PTC1  (via drill 0.35)
  Top 0.254: 13.34,24.09 13.34,24.77
  Top 0.305: IC1.32 13.34,24.09 | 13.34,24.77 14.61,26.04 v14.61,33.02
  Bottom 0.305: X2.7 28.57,56.52 27.94,55.88 27.94,54.61 27.3,53.98 27.3,52.7 21.59,46.99 21.59,36.83 17.78,33.02 v14.61,33.02
RESET  (via drill 0.35)
  Top 0.254: IC1.25 14.86,20.57 15.24,20.96
  Top 0.305: BDM.4 24.51,32.38 | 24.51,32.38 24.13,32.38 | 24.13,32.38 24.13,32 | 24.13,32 C11.1 | 24.13,32.38 24.13,32.77 | 24.13,32.77 R17.1 | 24.51,32.38 24.13,32.77 | 24.51,32.38 24.13,32 | v20.95,29.84 19.02,27.91 19.02,21.97 18.01,20.96 15.24,20.96
  Bottom 0.305: v20.95,29.84 23.5,32.38 BDM.4
SCL0/MOSI  (via drill 0.35)
  Top 0.254: IC1.28 16.99,22.07 17.78,22.86
  Top 0.305: 17.78,22.86 17.78,29.21 v18.41,29.84
  Bottom 0.305: X2.3 28.57,46.35 24.13,41.91 24.13,34.29 19.68,29.84 v18.41,29.84
SCL1
  Top 0.254: IC1.42 6.87,27.42 6.35,27.94
  Top 0.305: IC3.6 9.84,46.68 5.08,51.44 R4.1 4.12,50.48 1.27,47.62 1.27,30.38 3.71,27.94 6.35,27.94
SDA0/MISO  (via drill 0.35)
  Top 0.254: IC1.27 17.76,21.57
  Top 0.305: 17.76,21.57 18.41,22.23 18.41,28.57 19.68,29.84 v19.68,32.38
  Bottom 0.305: X2.5 28.57,51.44 22.86,45.72 22.86,35.56 v19.68,32.38
SDA1  (via drill 0.35)
  Top 0.254: IC1.41 7.37,28.19
  Top 0.305: IC3.5 13.03,47.36 10.42,47.36 6.35,51.44 v6.35,52.7 5.08,53.98 R5.1 | 7.37,28.19 v6.35,29.21
  Bottom 0.305: v6.35,29.21 3.17,29.21 1.27,31.11 1.27,47.62 v6.35,52.7
SPSCK0  (via drill 0.35)
  Top 0.254: IC1.29 16.22,22.57 17.14,23.5
  Top 0.305: v18.41,31.11 17.14,29.84 17.14,23.5
  Bottom 0.305: X2.4 28.57,48.9 23.5,43.81 23.5,34.92 19.68,31.11 v18.41,31.11
SS0  (via drill 0.35)
  Top 0.254: IC1.30 15.45,23.07 16.51,24.13
  Top 0.305: 16.51,24.13 16.51,31.11 20.32,34.92 v20.32,36.83
  Bottom 0.305: X2.8 28.57,59.05 27.94,58.42 27.94,57.15 27.3,56.52 27.3,55.24 26.67,54.61 26.67,53.34 20.95,47.62 20.95,37.47 v20.32,36.83
XTAL  (via drill 0.35)
  Top 0.152: 26.99,23.18 27.3,23.5 27.3,23.88 Q2.2
  Top 0.254: IC1.22 15.22,19.07 15.95,18.34
  Top 0.305: 26.99,23.18 C3.1 R10.2 21.91,20.32 v19.68,20.32 | 15.95,18.34 v16.58,18.34
  Bottom 0.305: v16.58,18.34 17.71,18.34 v19.68,20.32
XTAL1
  Top 0.305: IC3.2 16.43,46.03 15.99,46.47 15.99,51.86 C7.1 14.61,52.07 13.97,52.7 R3.2 14.29,54.61 Q4.2

### Text on the board
tPlace: SS | MISO | SPSCK | MOSI | 3V3 | GND
bPlace: FSS / Andreas Auer / 2021 / TFO-Meran